# Altium schematic sheet pripherals.SchDoc
size A4; SheetNumber: 2; SheetTotal: 2; SPICEModelCacheJVNAYKJN: <root> / <DocumentId>JVNAYKJN</DocumentId> / <CacheFrame Number="0"> / <Model Name="cap" Kind="MDL"> / <Text>*Default semiconductor capacitor / .MODEL CAP C()</Text> / </Model> / </CacheFrame> / </root>
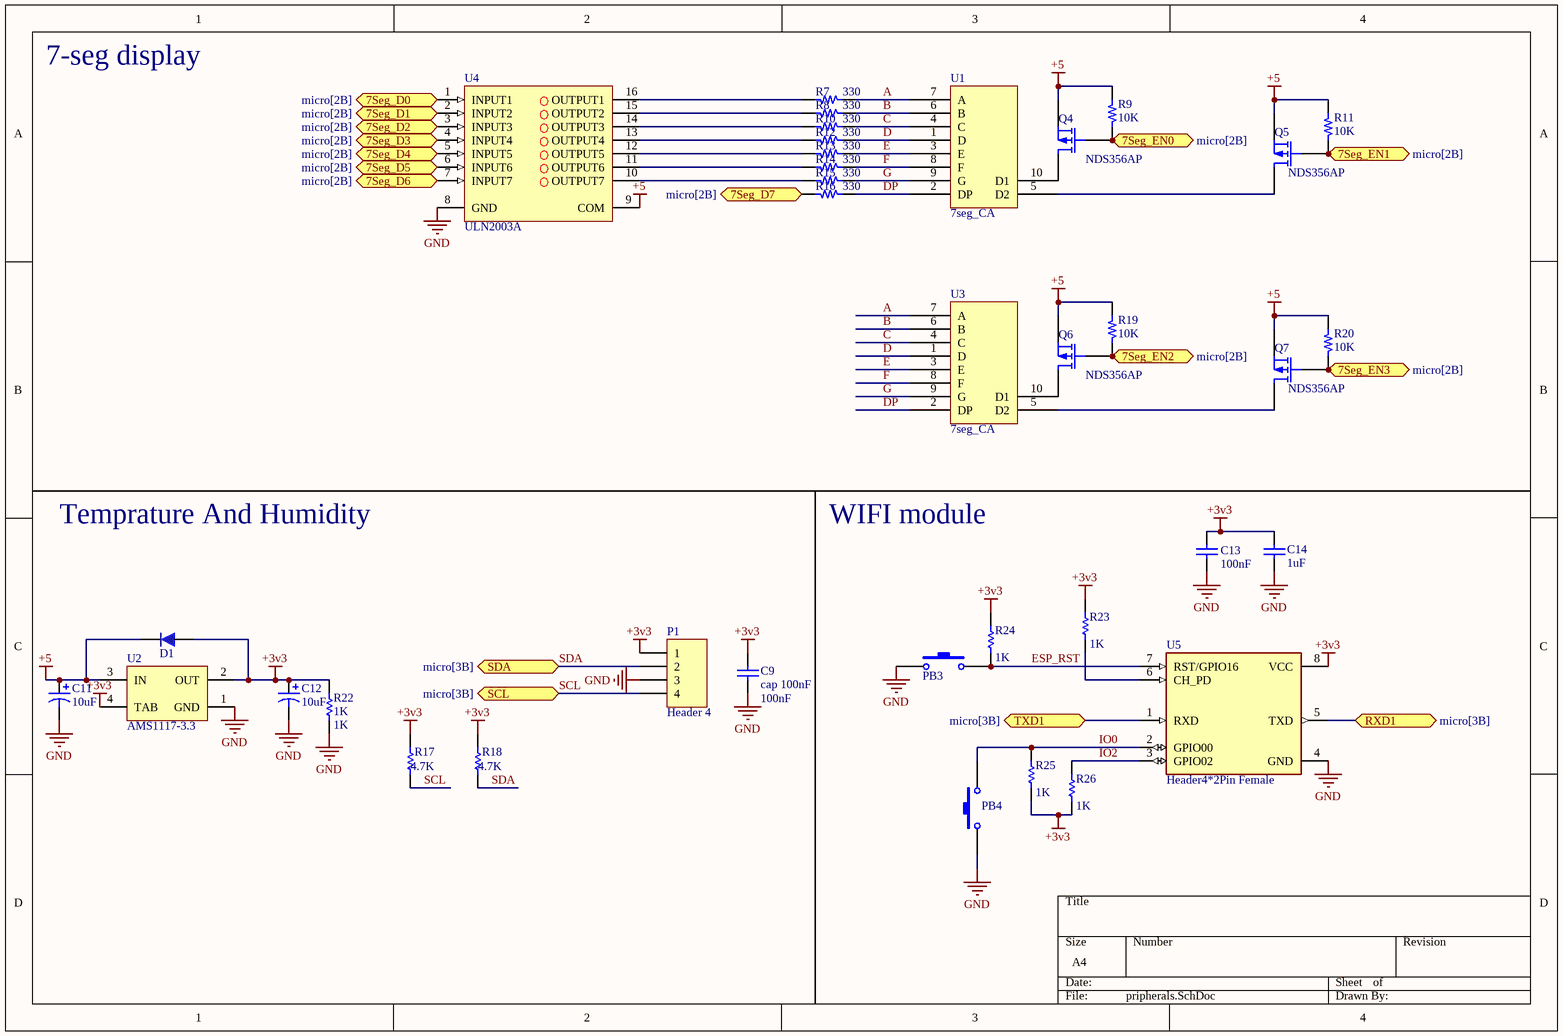
[diagram p0: pripherals.SchDoc]

## Parts
C9  cap 100nF  value 100nF  [Cap 805]
C11  value 10uF  [CAP0805]  (hidden comment: cap 10uF)
C12  value 10uF  [CAP0805]  (hidden comment: cap 10uF)
C13  value 100nF  [CAP0805]  (hidden comment: cap 100nF)
C14  value 1uF  [CAP0805]  (hidden comment: cap 1uF)
D1  uf4007  [DIOM4629X24N]  (value not drawn)
P1  Header 4  [HDR1X4]
PB3  Push-Button-tall  [tack-sw-3x5x6]  (value not drawn)
PB4  Push-Button-tall  [tack-sw-3x5x6]  (value not drawn)
Q4  NDS356AP  [soT95p280x130-3n]
Q5  NDS356AP  [soT95p280x130-3n]
Q6  NDS356AP  [soT95p280x130-3n]
Q7  NDS356AP  [soT95p280x130-3n]
R7  330  [RES0805]
R8  330  [RES0805]
R9  10K  [RES0805]
R10  330  [RES0805]
R11  10K  [RES0805]
R12  330  [RES0805]
R13  330  [RES0805]
R14  330  [RES0805]
R15  330  [RES0805]
R16  330  [RES0805]
R17  value 4.7K  [RES0805]  (hidden comment: Res 4.7K)
R18  value 4.7K  [RES0805]  (hidden comment: Res 4.7K)
R19  10K  [RES0805]
R20  10K  [RES0805]
R22  1K  [RES0805]
R23  value 1K  [RES0805]  (hidden comment: Res 1K)
R24  value 1K  [RES0805]  (hidden comment: Res 1K)
R25  value 1K  [RES0805]  (hidden comment: Res 1K)
R26  value 1K  [RES0805]  (hidden comment: Res 1K)
U1  7seg_CA  [7seg]
U2  AMS1117-3.3  [SOT223]
U3  7seg_CA  [7seg]
U4  ULN2003A  [SO16_N]
U5  Header4*2Pin Female  [ESP8266-01/ESP-01]

## Ports
7Seg_D0 (bidir, see micro[2B]), 7Seg_D1 (bidir, see micro[2B]), 7Seg_D2 (bidir, see micro[2B]), 7Seg_D3 (bidir, see micro[2B]), 7Seg_D4 (bidir, see micro[2B]), 7Seg_D5 (bidir, see micro[2B]), 7Seg_D6 (bidir, see micro[2B]), 7Seg_D7 (bidir, see micro[2B]), 7Seg_EN0 (bidir, see micro[2B]), 7Seg_EN1 (bidir, see micro[2B]), 7Seg_EN2 (bidir, see micro[2B]), 7Seg_EN3 (bidir, see micro[2B]), RXD1 (bidir, see micro[3B]), SCL (bidir, see micro[3B]), SDA (bidir, see micro[3B]), TXD1 (bidir, see micro[3B])

## Nets
+3v3: C9.2 C12.1 C13.2 C14.1 D1.1 P1.1 R17.1 R18.1 R22.2 R23.1 R24.1 R25.2 R26.2 U2.2(OUT) U2.4(TAB) U5.8(VCC)
+5: C11.1 D1.2 Q4.3(S) Q5.3(S) Q6.3(S) Q7.3(S) R9.1 R11.1 R19.1 R20.1 U2.3(IN) U4.9(COM)
GND: C9.1 C11.2 C12.2 C13.1 C14.2 P1.3 PB3.1 PB4.1 R22.1 U2.1(GND) U4.8(GND) U5.4(GND)
7Seg_D0: U4.1(INPUT1) ; port 7Seg_D0
7Seg_D1: U4.2(INPUT2) ; port 7Seg_D1
7Seg_D2: U4.3(INPUT3) ; port 7Seg_D2
7Seg_D3: U4.4(INPUT4) ; port 7Seg_D3
7Seg_D4: U4.5(INPUT5) ; port 7Seg_D4
7Seg_D5: U4.6(INPUT6) ; port 7Seg_D5
7Seg_D6: U4.7(INPUT7) ; port 7Seg_D6
7Seg_D7: R16.1 ; port 7Seg_D7
7Seg_EN0: Q4.2(G) R9.2 ; port 7Seg_EN0
7Seg_EN1: Q5.2(G) R11.2 ; port 7Seg_EN1
7Seg_EN2: Q6.2(G) R19.2 ; port 7Seg_EN2
7Seg_EN3: Q7.2(G) R20.2 ; port 7Seg_EN3
A: R7.2 U1.7(A) U3.7(A)
B: R8.2 U1.6(B) U3.6(B)
C: R10.2 U1.4(C) U3.4(C)
D: R12.2 U1.1(D) U3.1(D)
DP: R16.2 U1.2(DP) U3.2(DP)
E: R13.2 U1.3(E) U3.3(E)
ESP_RST: PB3.2 R24.2 U5.7(RST/GPIO16)
F: R14.2 U1.8(F) U3.8(F)
G: R15.2 U1.9(G) U3.9(G)
IO0: PB4.2 R25.1 U5.2(GPIO00)
IO2: R26.1 U5.3(GPIO02)
RXD1: U5.5(TXD) ; port RXD1
SCL: P1.4 R17.2 ; port SCL
SDA: P1.2 R18.2 ; port SDA
TXD1: U5.1(RXD) ; port TXD1
NetQ4_1: Q4.1(D) U1.10(D1)
NetQ5_1: Q5.1(D) U1.5(D2)
NetQ6_1: Q6.1(D) U3.10(D1)
NetQ7_1: Q7.1(D) U3.5(D2)
NetR7_1: R7.1 U4.16(OUTPUT1)
NetR8_1: R8.1 U4.15(OUTPUT2)
NetR10_1: R10.1 U4.14(OUTPUT3)
NetR12_1: R12.1 U4.13(OUTPUT4)
NetR13_1: R13.1 U4.12(OUTPUT5)
NetR14_1: R14.1 U4.11(OUTPUT6)
NetR15_1: R15.1 U4.10(OUTPUT7)
NetR23_2: R23.2 U5.6(CH_PD)

## Notes on the sheet
- 7-seg display
- Temprature And Humidity
- WIFI module

## Library data of the parts
C9 = Cap: Capacitor; Published: 8-Jun-2000; LatestRevisionDate: 17-Jul-2002; LatestRevisionNote: Re-released for DXP Platform.; PackageReference: RAD-0.3; Publisher: Altium Limited; PackageDescription: Radial Cap, Thru-Hole; 2 Leads; 0.3 in Pin Spacing
C11 C12 = Cap Pol1: CAP seramic; Published: 8-Jun-2000; LatestRevisionDate: 17-Jul-2002; LatestRevisionNote: Re-released for DXP Platform.; PackageReference: RB7.6-15; Publisher: Altium Limited; PackageDescription: Polarized Capacitor (Radial); 2 Leads
C13 C14 = Cap ceramic: CAP seramic
D1 = 1n4007 SMD M7: Standard Rectifiers; Part. No: M7; Manufacturer: DC COMPONENTS; Designer: Abbas Basereh; Link: http://www.tme.eu/en/details/m7/smd-universal-diodes/dc-components/; Link: https://www.aliexpress.com/item/Smd-tube-1n4007-m7-SMA/1213719741.html?spm=2114.01010208.3.1.ZyZ7bC&ws_ab_test=searchweb0_0,searchweb201602_4_10065_10068_10084_10083_10080_10082_10081_10060_10061_10062_10056_10055_10054_10059_10099_10078_10079_427_10073_10103_10102_10096_10052_10050_10051,searchweb201603_4&btsid=db2be5ca-e560-400a-b91c-484ab5ee228b; Data: 16-12-2016
P1 = Header 4: Header, 4-Pin; LatestRevisionDate: 17-Jul-2002; LatestRevisionNote: Re-released for DXP Platform.; Publisher: Altium Limited
Q4-Q7 = MOSFET-P: P-Channel MOSFET SOT23; pin to pad: 1>3 2>1 3>2; Published: 8-Jun-2000; LatestRevisionDate: 17-Jul-2002; LatestRevisionNote: Re-released for DXP Platform.; PackageVersion: 1995/1996; PackageReference: E3; Publisher: Altium Limited; PackageDescription: TO, Flat Index; 3 In-Line, Axial Leads; Body Dia. 4.6mm; Lead Dia. 0.5 mm (max)
R7-R16 R19 R20 = Resistor: RES SMD 0603; Part Number: RCS0805100KFKEA
  R7 R8 R10 R12-R16: Value: 330
  R9 R11 R19 R20: Value: 10K
R17 R18 R22-R26 = Res1: Resistor; Published: 8-Jun-2000; LatestRevisionDate: 17-Jul-2002; LatestRevisionNote: Re-released for DXP Platform.; PackageReference: AXIAL-0.3; Publisher: Altium Limited; PackageDescription: Axial Device, Thru-Hole; 2 Leads; 0.3 in Pin Spacing
  R22: Value: 1K
U1 U3 = 7Seg-2digit-ca
U2 = AMS1117-x.x: x.x Volt, 800mA Low-Dropout Linear Regulator, 4-pin SOT-223; Designer: Ali Hafizi; Data: 16-12-2016
U4 = ULN2003A: SEVEN DARLINGTON ARRAYS; Published: 2017-3-2; DatasheetVersion: STMicroelectronics GROUP OF COMPANIES; PackageVersion: 2017-3-2; PackageReference: SO16_N; Publisher: Abbas Basereh; PackageDescription: 16-Pin Small Outline Integrated Circuit 1.27 mm Pitch, IPC High Density; Supplier 1: Digi-Key; Supplier Part Number 1: ULN2003A; Supplier 2: Mouser; Supplier Part Number 2: ULN2003A; ComponentLink1Description: Datasheet; ComponentLink2URL: http://www.st.com
U5 = ESP8266-01/ESP-01: ESP-01 wifi module; MF: AI-Thinker; Package: None; Availability: Unavailable; MP: ESP8266-01/ESP-01; Value: *; SnapEDA_Link: https://www.snapeda.com/parts/ESP8266-01/ESP-01/AI-Thinker/view-part/106413/?ref=snap; Price: None